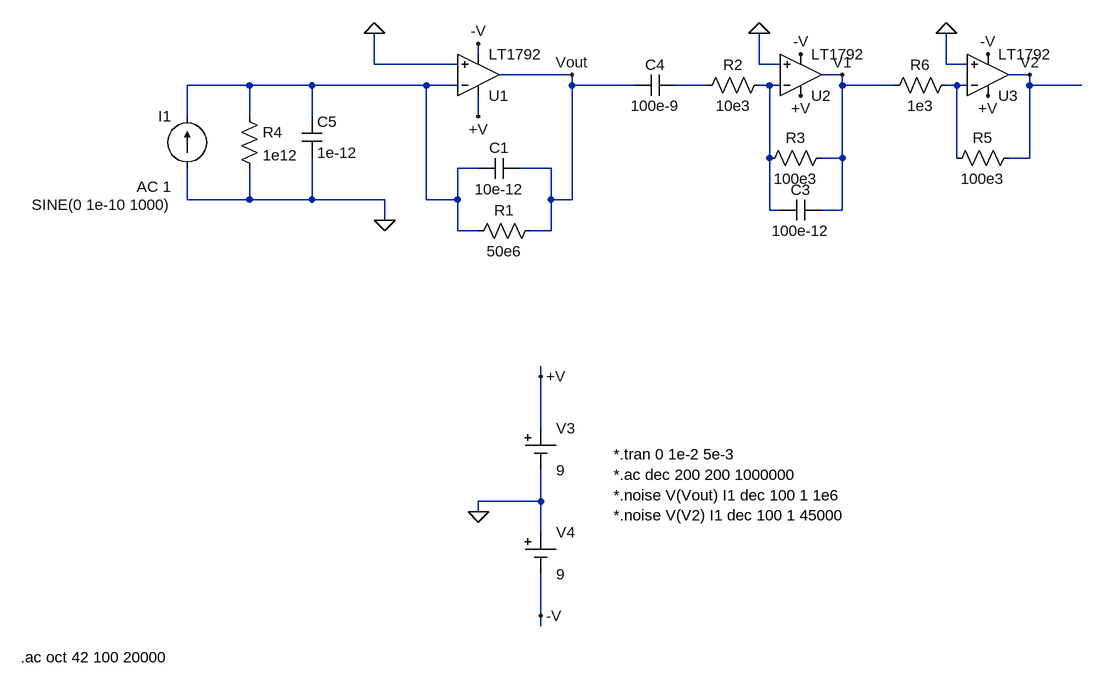
[diagram p0: schematic charge_amp_LT1792_three_stages.asc]
charge_amp_LT1792_three_stages.asc, the LTspice schematic file:
Version 4
SHEET 1 2044 1532
WIRE 544 528 544 512
WIRE 384 544 384 496
WIRE 512 544 384 544
WIRE 976 544 976 496
WIRE 1008 544 976 544
WIRE 1264 544 1264 496
WIRE 1296 544 1264 544
WIRE 688 560 576 560
WIRE 1104 560 1072 560
WIRE 1392 560 1360 560
WIRE 192 576 96 576
WIRE 288 576 192 576
WIRE 464 576 288 576
WIRE 512 576 464 576
WIRE 688 576 688 560
WIRE 784 576 688 576
WIRE 896 576 848 576
WIRE 992 576 976 576
WIRE 1008 576 992 576
WIRE 1104 576 1104 560
WIRE 1184 576 1104 576
WIRE 1280 576 1264 576
WIRE 1296 576 1280 576
WIRE 1392 576 1392 560
WIRE 1472 576 1392 576
WIRE 96 624 96 576
WIRE 192 624 192 576
WIRE 288 624 288 576
WIRE 544 624 544 592
WIRE 992 688 992 576
WIRE 1104 688 1104 576
WIRE 1104 688 1072 688
WIRE 1280 688 1280 576
WIRE 1392 688 1392 576
WIRE 1392 688 1360 688
WIRE 544 704 512 704
WIRE 656 704 608 704
WIRE 96 752 96 704
WIRE 192 752 192 704
WIRE 192 752 96 752
WIRE 288 752 288 688
WIRE 288 752 192 752
WIRE 400 752 288 752
WIRE 464 752 464 576
WIRE 512 752 512 704
WIRE 512 752 464 752
WIRE 656 752 656 704
WIRE 688 752 688 576
WIRE 688 752 656 752
WIRE 992 768 992 688
WIRE 1008 768 992 768
WIRE 1104 768 1104 688
WIRE 1104 768 1072 768
WIRE 400 784 400 752
WIRE 512 800 512 752
WIRE 544 800 512 800
WIRE 656 800 656 752
WIRE 656 800 624 800
WIRE 640 1024 640 1008
WIRE 640 1104 640 1024
WIRE 640 1216 640 1168
WIRE 640 1216 544 1216
WIRE 544 1232 544 1216
WIRE 640 1264 640 1216
WIRE 640 1392 640 1328
WIRE 640 1408 640 1392
FLAG 400 784 0
FLAG 544 1232 0
FLAG 384 496 0
FLAG 544 624 +V
FLAG 544 512 -V
FLAG 688 560 Vout
FLAG 1040 592 +V
FLAG 1040 528 -V
FLAG 1104 560 V1
FLAG 976 496 0
FLAG 640 1392 -V
FLAG 640 1024 +V
FLAG 1328 592 +V
FLAG 1328 528 -V
FLAG 1392 560 V2
FLAG 1264 496 0
SYMBOL res 640 784 R90
WINDOW 0 0 56 VBottom 2
WINDOW 3 32 56 VTop 2
SYMATTR InstName R1
SYMATTR Value 50e6
SYMBOL cap 608 688 R90
WINDOW 0 0 32 VBottom 2
WINDOW 3 32 32 VTop 2
SYMATTR InstName C1
SYMATTR Value 10e-12
SYMBOL res 1088 672 R90
WINDOW 0 0 56 VBottom 2
WINDOW 3 32 56 VTop 2
SYMATTR InstName R3
SYMATTR Value 100e3
SYMBOL res 880 592 R270
WINDOW 0 32 56 VTop 2
WINDOW 3 0 56 VBottom 2
SYMATTR InstName R2
SYMATTR Value 10e3
SYMBOL cap 1072 752 R90
WINDOW 0 0 32 VBottom 2
WINDOW 3 32 32 VTop 2
SYMATTR InstName C3
SYMATTR Value 100e-12
SYMBOL cap 848 560 R90
WINDOW 0 0 32 VBottom 2
WINDOW 3 32 32 VTop 2
SYMATTR InstName C4
SYMATTR Value 100e-9
SYMBOL current 96 704 R180
WINDOW 0 24 80 Left 2
WINDOW 3 24 -56 Left 2
WINDOW 123 24 -28 Left 2
WINDOW 39 0 0 Left 0
SYMATTR InstName I1
SYMATTR Value SINE(0 1e-10 1000)
SYMATTR Value2 AC 1
SYMBOL Opamps\\LT1792 1040 624 M180
SYMATTR InstName U2
SYMBOL res 176 608 R0
SYMATTR InstName R4
SYMATTR Value 1e12
SYMBOL cap 272 624 R0
SYMATTR InstName C5
SYMATTR Value 1e-12
SYMBOL Misc\\cell 640 1104 R0
WINDOW 123 0 0 Left 0
WINDOW 39 0 0 Left 0
SYMATTR InstName V3
SYMATTR Value 9
SYMBOL Misc\\cell 640 1264 R0
WINDOW 123 0 0 Left 0
WINDOW 39 0 0 Left 0
SYMATTR InstName V4
SYMATTR Value 9
SYMBOL Opamps\\LT1792 544 624 M180
SYMATTR InstName U1
SYMBOL res 1376 672 R90
WINDOW 0 0 56 VBottom 2
WINDOW 3 32 56 VTop 2
SYMATTR InstName R5
SYMATTR Value 100e3
SYMBOL res 1168 592 R270
WINDOW 0 32 56 VTop 2
WINDOW 3 0 56 VBottom 2
SYMATTR InstName R6
SYMATTR Value 1e3
SYMBOL Opamps\\LT1792 1328 624 M180
SYMATTR InstName U3
TEXT 752 1144 Left 2 !*.tran 0 1e-2 5e-3\n*.ac dec 200 200 1000000\n*.noise V(Vout) I1 dec 100 1 1e6\n*.noise V(V2) I1 dec 100 1 45000
TEXT -160 1456 Left 2 !.ac oct 42 100 20000

The netlist it stands for:
* charge_amp_LT1792_three_stages.asc
R1 Vout N001 50e6
C1 Vout N001 10e-12
R3 V1 N003 100e3
R2 N002 N003 10e3
C3 V1 N003 100e-12
C4 N002 Vout 100e-9
I1 0 N001 SINE(0 1e-10 1000) AC 1
XU2 0 N003 +V -V V1 LT1792  ; pins In+ In- V+ V- OUT
R4 N001 0 1e12
C5 N001 0 1e-12
V3 +V 0 9
V4 0 -V 9
XU1 0 N001 +V -V Vout LT1792  ; pins In+ In- V+ V- OUT
R5 V2 N004 100e3
R6 V1 N004 1e3
XU3 0 N004 +V -V V2 LT1792  ; pins In+ In- V+ V- OUT
*.tran 0 1e-2 5e-3
*.ac dec 200 200 1000000
*.noise V(Vout) I1 dec 100 1 1e6
*.noise V(V2) I1 dec 100 1 45000
.ac oct 42 100 20000
.backanno
.end

* Results of the author's LTspice run, read from the files saved beside the schematic
* Operating Point, zero values left out:
*   V(+v) = 9 V
*   V(-v) = -9 V
*   I(V4) = -12.6 mA
*   I(V3) = -12.6 mA
*   Ix(u2:3) = 4.199 mA
*   Ix(u2:4) = -4.199 mA
*   Ix(u1:3) = 4.199 mA
*   Ix(u1:4) = -4.199 mA
*   Ix(u3:3) = 4.199 mA
*   Ix(u3:4) = -4.199 mA
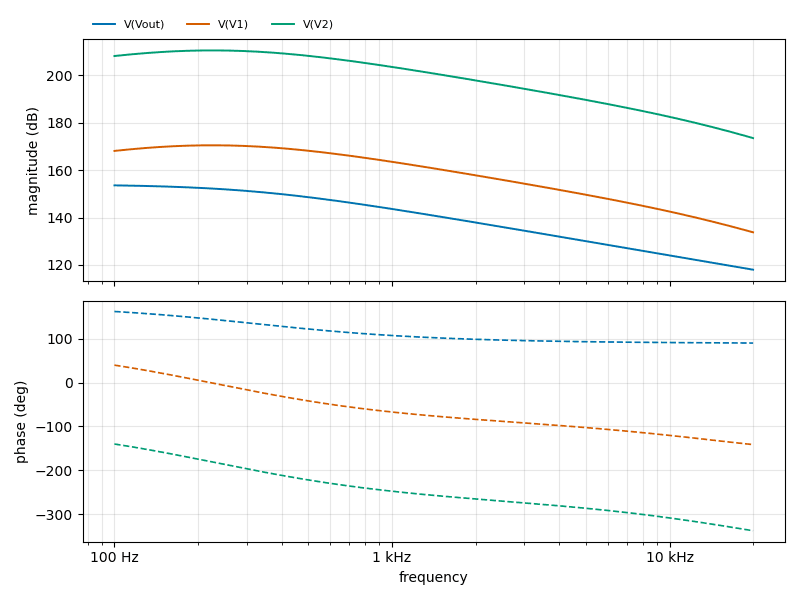
[diagram p1: AC Analysis of charge_amp_LT1792_three_stages.asc, plotted from the saved traces]
* AC Analysis, 1 run:
*   V(Vout): 153.57 dB at 100 Hz, 118.02 dB at 20 kHz, peak 153.57 dB at 100 Hz, 3 dB below the peak at 348.3 Hz
*   V(V1): 168.09 dB at 100 Hz, 133.78 dB at 20 kHz, peak 170.46 dB at 224.5 Hz, 3 dB below the peak at 566.5 Hz
*   V(V2): 208.09 dB at 100 Hz, 173.49 dB at 20 kHz, peak 210.46 dB at 224.5 Hz, 3 dB below the peak at 566.4 Hz